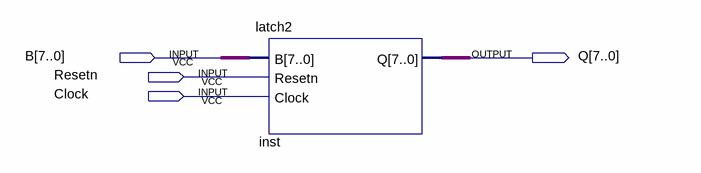
[diagram p0: schematic sheet]
// Quartus schematic latch2bdf.bdf as structural Verilog: 1 symbols, 4 pins
module latch2bdf (
  input  [7:0] B,
  input  Resetn,
  input  Clock,
  output [7:0] Q
);

  latch2 inst (.B(B), .Resetn(Resetn), .Clock(Clock), .Q(Q));
endmodule
